# Altium schematic sheet Power.SchDoc
size A4; SheetNumber: 2; SheetTotal: 4
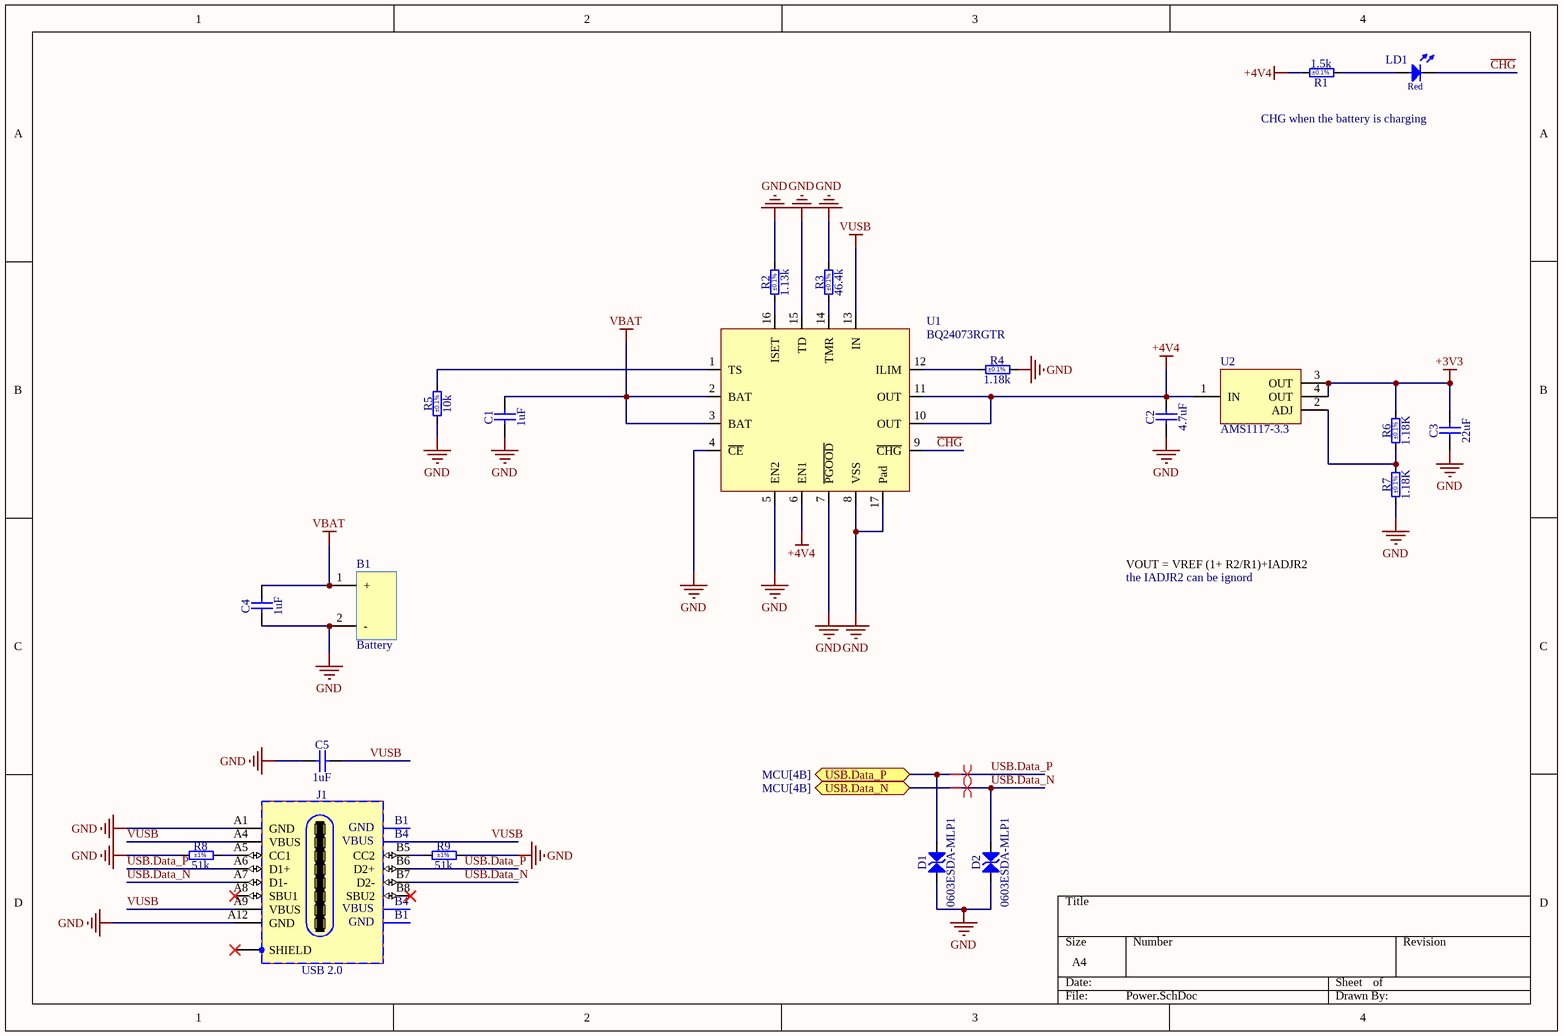
[diagram p0: Power.SchDoc]

## Parts
B1  Battery  [PCB.Battery.Holder.14500]
C1  1uF  [CAPC1608X90N]
C2  4.7uF  [CAPC1608X90N]
C3  22uF  [CAPC1608X90N]
C4  1uF  [CAPC1608X90N]
C5  1uF  [CAPC1608X90N]
D1  0603ESDA-MLP1  [EATON_0603ESDA-MLP]
D2  0603ESDA-MLP1  [EATON_0603ESDA-MLP]
J1  USB 2.0  [GCT_USB4105-GF-A]
LD1  Red  [LED_DIALIGHT_598-8010-107F]
R1  1.5k  Tolerance: ±0.1%  [RESC1608X55N]
R2  1.13k  Tolerance: ±0.1%  [RESC1608X55N]
R3  46.4k  Tolerance: ±0.1%  [RESC1608X55N]
R4  1.18k  Tolerance: ±0.1%  [RESC1608X55N]
R5  10k  Tolerance: ±0.1%  [RESC1608X55N]
R6  1.18K  Tolerance: ±0.1%  [RESC1608X55N]
R7  1.18K  Tolerance: ±0.1%  [RESC1608X55N]
R8  51k  Tolerance: ±1%  [RESC1608X55N]
R9  51k  Tolerance: ±1%  [RESC1608X55N]
U1  BQ24073RGTR  [bq24073]
U2  AMS1117-3.3  [IC.AMS1117-3.3]

## Ports
USB.Data_N (bidir, see MCU[4B]), USB.Data_P (bidir, see MCU[4B])

## Nets
+3V3: C3.2 R6.2 U2.3(OUT) U2.4(OUT)
+4V4: C2.2 R1.2 U1.6(EN1) U1.10(OUT) U1.11(OUT) U2.1(IN)
GND: B1.2(-) C1.1 C2.1 C3.1 C4.1 C5.1 D1.1 D2.1 J1.A1(GND) J1.A12(GND) R2.2 R3.2 R4.2 R5.1 R7.1 R8.1 R9.2 U1.4(~{CE}) U1.5(EN2) U1.7(~{PGOOD}) U1.8(VSS) U1.15(TD) U1.17(Pad)
VBAT: B1.1(+) C1.2 C4.2 U1.2(BAT) U1.3(BAT)
VUSB: C5.2 J1.A4(VBUS) J1.A9(VBUS) U1.13(IN)
~{CHG}: LD1.1(C) U1.9(~{CHG})
USB.Data_N: D2.2 J1.A7(D1-) J1.B7(D2-) ; port USB.Data_N
USB.Data_P: D1.2 J1.A6(D1+) J1.B6(D2+) ; port USB.Data_P
NetJ1_A5: J1.A5(CC1) R8.2
NetJ1_B5: J1.B5(CC2) R9.1
NetLD1_2: LD1.2(A) R1.1
NetR2_1: R2.1 U1.16(ISET)
NetR3_1: R3.1 U1.14(TMR)
NetR4_1: R4.1 U1.12(ILIM)
NetR5_2: R5.2 U1.1(TS)
NetR6_1: R6.1 R7.2 U2.2(ADJ)

Not connected (* = marked no-connect by the designer): J1 A8(SBU1)* B8(SBU2)* SHIELD*

## Layout directives
differential pair: USB.Data_N, USB.Data_P

## Notes on the sheet
- CHG when the battery is charging
- VOUT = VREF (1+ R2/R1)+IADJR2
- the IADJR2 can be ignord
- (in symbol GCT_USB4105-GF-A) B1; B4

## Library data of the parts
B1 = PCB.Battery.Holder.14500: PCB Battery Holder Embeded in PCB
C1 C4 C5 = CC0603_1UF_10V_10%_X5R: Non-polarised capacitor; Part Description: SMD Multilayer Chip Ceramic Capacitor; Manufacturer: GENERIC; Manufacturer1 Part Number: 0603ZD105KAT; Voltage: 10V; TC: X5R; Tolerance: ±10%; Part Number: CC0603_1UF_10V_10%_X5R; Component Kind: Standard; Component Type: Standard; Pin Count: 2; Value: 1uF; Status: None; Manufacturer Part Number: CC0603_1UF_10V_10%_X5R; Case: 0603; Mounted: Yes; Socket: No; SMD: Yes; Sense: No; Manufacturer1 Example: AVX; Manufacturer1 ComponentHeight: 0.9mm; HelpURL: \\cern.ch\dfs\Applications\Altium\Datasheets\CC0603_X5R_AVX_0603ZD105KAT.pdf; Author: CERN DEM HF; CreateDate: 7/10/2023; LatestRevisionDate: 7/10/2023
C2 = CC0603_4.7UF_10V_10%_X5R: Non-polarised capacitor; Part Description: SMD Multilayer Chip Ceramic Capacitor; Manufacturer: GENERIC; Manufacturer1 Part Number: C1608X5R1A475K080; Voltage: 10V; TC: X5R; Tolerance: ±10%; Part Number: CC0603_4.7UF_10V_10%_X5R; Component Kind: Standard; Component Type: Standard; Pin Count: 2; Value: 4.7uF; Status: Preferred; Manufacturer Part Number: CC0603_4.7UF_10V_10%_X5R; Case: 0603; Mounted: Yes; Socket: No; SMD: Yes; Sense: No; Manufacturer1 Example: TDK; Manufacturer1 ComponentHeight: 0.95mm; HelpURL: \\cern.ch\dfs\Applications\Altium\Datasheets\CC0603_X5R_TDK_C_Serie.pdf; Author: CERN DEM HF; CreateDate: 7/10/2023; LatestRevisionDate: 7/10/2023
C3 = CC0603_22UF_10V_20%_X5R: Non-polarised capacitor; Part Description: SMD Multilayer Chip Ceramic Capacitor; Manufacturer: GENERIC; Manufacturer1 Part Number: C1608X5R1A226M080; Voltage: 10V; TC: X5R; Tolerance: ±20%; Part Number: CC0603_22UF_10V_20%_X5R; Component Kind: Standard; Component Type: Standard; Pin Count: 2; Value: 22uF; Status: None; Manufacturer Part Number: CC0603_22UF_10V_20%_X5R; Case: 0603; Mounted: Yes; Socket: No; SMD: Yes; Sense: No; Manufacturer1 Example: TDK; Manufacturer1 ComponentHeight: 0.9mm; HelpURL: \\cern.ch\dfs\Applications\Altium\Datasheets\CC0603_X5R_TDK_C.pdf; Author: CERN DEM BC; CreateDate: 12/3/2020; LatestRevisionDate: 12/3/2020
D1 D2 = 0603ESDA-MLP1: Transient Voltage Suppressor Diode (Bi-Directional); Part Description: 0.05pF 8kV Bidirectional ESD Voltage Suppressor; Manufacturer: EATON; Voltage: 8kV; PressFit: No; Bonding: No; Part Number: 0603ESDA-MLP1; Component Kind: Standard; Component Type: Standard; Device: 0603ESDA-MLP1; PackageDescription: 0603, 2-Leads, Body 1.1mm L X 0.53mm W X 0.44mm H body, IPC Medium Density; Manufacturer Part Number: 0603ESDA-MLP1; Pin Count: 2; Case: 0603; Mounted: Yes; Socket: No; SMD: Yes; Sense: No; ComponentHeight: 0.38mm; HelpURL: \\cern.ch\dfs\Applications\Altium\Datasheets\0603ESDA-MLP1.pdf; Author: CERN DEM HF; CreateDate: 9/21/2022; LatestRevisionDate: 9/21/2022
J1 = GCT_USB4105-GF-A: 2x8 Pin + 1 Shield  USB Type C Receptacle; Part Description: USB 2.0 Type C Receptacle 16 Contacts, SMD, horizontal; Manufacturer: GCT; PressFit: No; Part Number: GCT_USB4105-GF-A; Component Kind: Standard; Component Type: Standard; Pin Count: 20; Family: USB 2.0; Mounted: Yes; Socket: No; SMD: Yes; Sense: No; Status: None; Manufacturer Part Number: USB4105-GF-A; ComponentHeight: 3.31mm; HelpURL: \\cern.ch\dfs\Applications\Altium\Datasheets\GCT_USB4105-GF-A.pdf; Author: CERN DEM HF; CreateDate: 10/12/2023; LatestRevisionDate: 10/12/2023
LD1 = LED_DIALIGHT_598-8010-107F: LED Red 1C 2A; Part Description: Micro SMD Red Led, 598 Series; PressFit: No; Bonding: No; Part Number: LED_DIALIGHT_598-8010-107F; Component Kind: Standard; Component Type: Standard; Color: Red; PackageDescription: SMT Red LED, Body 1.6x0.8mm, 0603 Case,  DIALIGHT 598 Series; Manufacturer: DIALIGHT; Manufacturer Part Number: 598-8010-107F; Pin Count: 2; Case: 0603; Mounted: Yes; Socket: No; SMD: Yes; Sense: No; ComponentHeight: 0.7mm; HelpURL: \\cern.ch\dfs\Applications\Altium\Datasheets\LED_DIALIGHT_598-8010-107F.pdf; Author: CERN DEM MR; CreateDate: 1/9/2017; LatestRevisionDate: 1/9/2017
R1-R5 = R0603_10K_0.1%_0.063W_10PPM: Resistor - 0.1%; Part Description: Thin Film Chip Resistor; Manufacturer: GENERIC; Manufacturer1 Part Number: RN73C1J10KBTDF; Power: 0.063W; TC: ±10ppm; PressFit: No; Part Number: R0603_10K_0.1%_0.063W_10PPM; Component Kind: Standard; Component Type: Standard; Pin Count: 2; Status: Not Recommended; Manufacturer Part Number: R0603_10K_0.1%_0.063W_10PPM; Case: 0603; Mounted: Yes; Sense: No; Socket: No; SMD: Yes; Manufacturer1 Example: TYCO HOLSWORTHY; Manufacturer1 ComponentHeight: 0.5mm; HelpURL: \\cern.ch\dfs\Applications\Altium\Datasheets\R0603_Tyco_RN73.pdf; Author: CERN DEM JLC; CreateDate: 12/3/2007; LatestRevisionDate: 3/13/2008
  R1: Value: 1.5k
  R2: Value: 1.13k
  R3: Value: 46.4k
  R4: Value: 1.18k
  R5: Value: 10k
R6 R7 = R0603_118R_0.1%_0.063W_10PPM: Resistor - 0.1%; Part Description: Thin Film Chip Resistor; Manufacturer: GENERIC; Manufacturer1 Part Number: RN73C1J118RBTDF; Power: 0.063W; TC: ±10ppm; PressFit: No; Part Number: R0603_118R_0.1%_0.063W_10PPM; Component Kind: Standard; Component Type: Standard; Pin Count: 2; Value: 1.18K; Status: Not Recommended; Manufacturer Part Number: R0603_118R_0.1%_0.063W_10PPM; Case: 0603; Mounted: Yes; Sense: No; Socket: No; SMD: Yes; Manufacturer1 Example: TYCO HOLSWORTHY; Manufacturer1 ComponentHeight: 0.5mm; HelpURL: \\cern.ch\dfs\Applications\Altium\Datasheets\R0603_Tyco_RN73.pdf; Author: CERN DEM JLC; CreateDate: 12/3/2007; LatestRevisionDate: 3/13/2008
R8 R9 = R0603_51K_1%_0.1W_100PPM: Resistor - 1%; Part Description: General Purpose Thick Film Chip Resistor; Manufacturer: GENERIC; Manufacturer1 Part Number: NRC06F5102TRF; Power: 0.1W; TC: ±100ppm/°C; PressFit: No; Part Number: R0603_51K_1%_0.1W_100PPM; Component Kind: Standard; Component Type: Standard; Pin Count: 2; Value: 51k; Status: Preferred; Manufacturer Part Number: R0603_51K_1%_0.1W_100PPM; Case: 0603; Mounted: Yes; Sense: No; Socket: No; SMD: Yes; Manufacturer1 Example: NIC COMPONENT; Manufacturer1 ComponentHeight: 0.55mm; HelpURL: \\cern.ch\dfs\Applications\Altium\Datasheets\R0603_NIC_NRC.pdf; Author: CERN DEM JLC; CreateDate: 12/3/2007; LatestRevisionDate: 3/13/2008
U1 = BQ24073RGTR: 1.5A USB-FRIENDLY Li-Ion BATTERY CHARGER AND POWER-PATH MANAGEMENT IC
U2 = IC.AMS1117-3.3: 72dB@(120Hz) 1A Fixed 3.3V Positive electrode SOT-223-3 Linear Voltage Regulators (LDO) ROHS